# Altium schematic sheet TOP.SchDoc: Body Basher
size A4; CompanyName: COSIC; DrawnBy: Jakov Sola; Engineer: Jakov Sola; SheetNumber: 1; SheetTotal: 6; ENG_APP_DATE: --/--/--; DSN_APP_DATE: --/--/--; CHK_APP_DATE: --/--/--
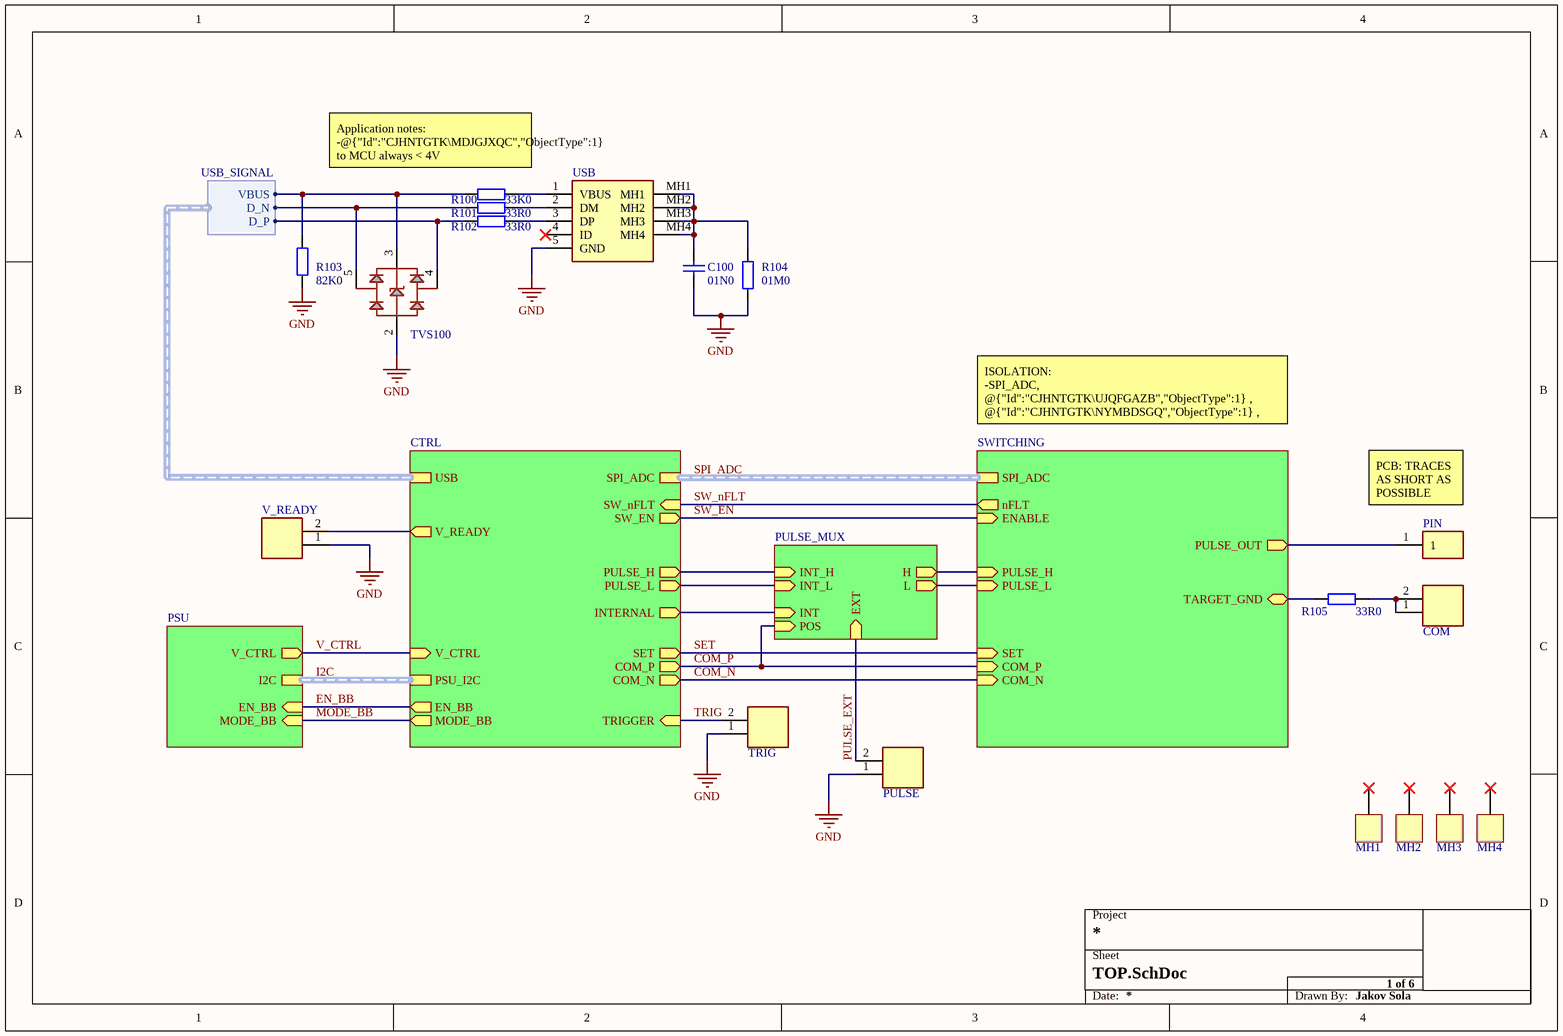
[diagram p0: TOP.SchDoc]

## Parts
C100  VALUE_4C: 01N0  [CAPC0805N]  (hidden comment: Cap)
COM  CON_2P  [2MMHBS02VT02HTB]  (value not drawn)
MH1  MH  [MH]  (value not drawn)  (no BOM)
MH2  MH  [MH]  (value not drawn)  (no BOM)
MH3  MH  [MH]  (value not drawn)  (no BOM)
MH4  MH  [MH]  (value not drawn)  (no BOM)
PIN  CON_1P  [POGO]  (value not drawn)
PULSE  CON_2P  [2MMHBS02VT02HTB]  (value not drawn)
R100  VALUE_4C: 33K0  [RESC0603N]  (hidden comment: Res)
R101  VALUE_4C: 33R0  [RESC0603N]  (hidden comment: Res)
R102  VALUE_4C: 33R0  [RESC0603N]  (hidden comment: Res)
R103  VALUE_4C: 82K0  [RESC0603N]  (hidden comment: Res)
R104  VALUE_4C: 01M0  [RESC0603N]  (hidden comment: Res)
R105  VALUE_4C: 33R0  [RESC0603N]  (hidden comment: Res)
TRIG  CON_2P  [2MMHBS02VT02HTB]  (value not drawn)
TVS100  SP3003_2X  [SC70_5]  (value not drawn)
USB  microUSB_CON  [476420001]  (value not drawn)
V_READY  CON_2P  [2MMHBS02VT02HTB]  (value not drawn)

## Sub-sheets
CTRL = CTRL.SchDoc: PULSE_H (out), PULSE_L (out), COM_P (out), COM_N (out), SET (out), SPI_ADC (harness SPI_ADC), TRIGGER (in), PSU_I2C (harness I2C), USB (harness USB_SIGNAL), MODE_BB (out), EN_BB (out), V_READY (out), SW_nFLT (in), SW_EN (out), INTERNAL (out), V_CTRL (in)
PSU = PSU.SchDoc: I2C (harness I2C), MODE_BB (in), EN_BB (in), V_CTRL (out)
PULSE_MUX = PULSE_MUX.SchDoc: INT_H (in), INT_L (in), EXT (in), H (out), L (out), INT (in), POS (in)
SWITCHING = SWITCHING.SchDoc: PULSE_H (in), PULSE_L (in), nFLT (out), ENABLE (in), PULSE_OUT (out), COM_P (in), COM_N (in), SET (in), TARGET_GND (bidir), SPI_ADC (harness SPI_ADC)

## Harnesses
USB_SIGNAL: D_P, D_N, VBUS

## Nets
GND: C100.1 PULSE.1 R103.1 R104.1 TRIG.1 TVS100.2 USB.5(GND) V_READY.1
COM_N: sheet SWITCHING/COM_N, sheet CTRL/COM_N
COM_P: sheet SWITCHING/COM_P, sheet CTRL/COM_P, sheet PULSE_MUX/POS
EN_BB: sheet PSU/EN_BB, sheet CTRL/EN_BB
MODE_BB: sheet PSU/MODE_BB, sheet CTRL/MODE_BB
PULSE_EXT: PULSE.2 ; sheet PULSE_MUX/EXT
SET: sheet SWITCHING/SET, sheet CTRL/SET
SW_EN: sheet SWITCHING/ENABLE, sheet CTRL/SW_EN
SW_nFLT: sheet SWITCHING/nFLT, sheet CTRL/SW_nFLT
TRIG: TRIG.2 ; sheet CTRL/TRIGGER
V_CTRL: sheet PSU/V_CTRL, sheet CTRL/V_CTRL
NetC100_2: C100.2 R104.2 USB.MH1 USB.MH2 USB.MH3 USB.MH4
NetCOM_1: COM.1 COM.2 R105.2
NetPIN_1: PIN.1 ; sheet SWITCHING/PULSE_OUT
NetR100_1: R100.1 USB.1(VBUS)
NetR100_2: R100.2 R103.2 TVS100.3 ; sheet CTRL/USB.VBUS
NetR101_1: R101.1 TVS100.5 ; sheet CTRL/USB.D_N
NetR101_2: R101.2 USB.2(DM)
NetR102_1: R102.1 TVS100.4 ; sheet CTRL/USB.D_P
NetR102_2: R102.2 USB.3(DP)
NetR105_1: R105.1 ; sheet SWITCHING/TARGET_GND
NetV_READY_2: V_READY.2 ; sheet CTRL/V_READY
(unnamed): sheet SWITCHING/PULSE_H, sheet PULSE_MUX/H
(unnamed): sheet SWITCHING/PULSE_L, sheet PULSE_MUX/L
(unnamed): sheet CTRL/PULSE_H, sheet PULSE_MUX/INT_H
(unnamed): sheet CTRL/PULSE_L, sheet PULSE_MUX/INT_L
(unnamed): sheet CTRL/INTERNAL, sheet PULSE_MUX/INT

Not connected (* = marked no-connect by the designer): MH1 0(MH)*; MH2 0(MH)*; MH3 0(MH)*; MH4 0(MH)*; USB 4(ID)*

## Buses and harness runs
harness I2C = sheet CTRL/PSU_I2C = sheet PSU/I2C
harness SPI_ADC = sheet CTRL/SPI_ADC = sheet SWITCHING/SPI_ADC

## Notes on the sheet
- Application notes:
  -@{"Id":"CJHNTGTK\MDJGJXQC","ObjectType":1} to MCU always < 4V
  -ESD protection
- ISOLATION:
  -SPI_ADC, @{"Id":"CJHNTGTK\UJQFGAZB","ObjectType":1} , @{"Id":"CJHNTGTK\NYMBDSGQ","ObjectType":1} , @{"Id":"CJHNTGTK\BMOAVTPZ","ObjectType":1} and @{"Id":"CJHNTGTK\TMLSETCT","ObjectType":1} isolated with ISOLATOR
  - @{"Id":"CJHNTGTK\TNVEIYGS","ObjectType":1} , @{"Id":"CJHNTGTK\KZAIASUD","ObjectType":1} and @{"Id":"CJHNTGTK\XAAZLINN","ObjectType":1} isolated with SSR inside SWITCHING
- (near PIN) PCB: TRACES AS SHORT AS POSSIBLE
- Project
- Sheet
- Date:
- Drawn By:

## Library data of the parts
C100 = 2238 600 15623: MANUF: PHYCOMP; DESCR: CAP 01N0 0805 100V X7R 10%; VENDOR: FARNELL INONE; VENDORCODE: 1362553; POPULATE: YES; VALUE_PF: 1000; VOLTAGE: 100V; TOLERANCE: 0.1; MANUFCODE: 2238 600 15623; PACKAGE: 0805; TECHNOLOGY: X7R
COM PULSE TRIG V_READY = 2MM-HB-S02-VT-02-H-TB: MANUF: TE CONNECTIVITY; DESCR: CON 2P 2MM HEADER; VENDOR: MOUSER; VENDORCODE: 571-2MM-HBS02VT02HTB; POPULATE: YES; MANUFCODE: 2MM-HB-S02-VT-02-H-TB
MH1-MH4 = MH: DESCR: MOUNTING HOLE; POPULATE: NA; MANUFCODE: MH
PIN = P25-0123: MANUF: HARWIN; DESCR: POGO PIN 15X5MM; VENDOR: MOUSER; VENDORCODE: 855-P25-0123; POPULATE: YES; MANUFCODE: P25-0123
R100 = CRCW060333K0FKEA: Resistor; MANUF: VISHAY; DESCR: RES 33K0 0603 0.1W 1% 75V 100PPM; VENDOR: DIGI-KEY; VENDORCODE: 541-33.0KHCT-ND; POPULATE: YES; VALUE_MOHM: 33000000; VALUE: 33K; POWER: 0.1W; TOLERANCE: 1%; VOLTAGE: 75V; TEMPCOEFF: 100PPM; NPOWER: 0.1; NTOLERANCE: 0.01; NVOLTAGE: 75; NTEMPCOEFF: 100; MANUFCODE: CRCW060333K0FKEA; PACKAGE: 0603; NVALUE: 33000000
R101 R102 R105 = CRCW060333R0FKEA: Resistor; MANUF: VISHAY; DESCR: RES 33R0 0603 0.1W 1% 75V 100PPM; VENDOR: DIGI-KEY; VENDORCODE: 541-33.0HCT-ND; POPULATE: YES; VALUE_MOHM: 33000; VALUE: 33R; POWER: 0.1W; TOLERANCE: 1%; VOLTAGE: 75V; TEMPCOEFF: 100PPM; NPOWER: 0.1; NTOLERANCE: 0.01; NVOLTAGE: 75; NTEMPCOEFF: 100; MANUFCODE: CRCW060333R0FKEA; PACKAGE: 0603; NVALUE: 33000
R103 = CRCW060382K0FKEA: Resistor; MANUF: VISHAY; DESCR: RES 82K0 0603 0.1W 1% 75V 100PPM; VENDOR: DIGI-KEY; VENDORCODE: 541-82.0KHCT-ND; POPULATE: YES; VALUE_MOHM: 82000000; VALUE: 82K; POWER: 0.1W; TOLERANCE: 1%; VOLTAGE: 75V; TEMPCOEFF: 100PPM; NPOWER: 0.1; NTOLERANCE: 0.01; NVOLTAGE: 75; NTEMPCOEFF: 100; MANUFCODE: CRCW060382K0FKEA; PACKAGE: 0603; NVALUE: 82000000
R104 = MC 0.063W 0603 1% 1M: Resistor; MANUF: MULTICOMP; DESCR: RES 01M0 0603 0.063W 1% 50V 100PPM; VENDOR: FARNELL INONE; VENDORCODE: 9330410; POPULATE: YES; VALUE_MOHM: 1000000000; VALUE: 1M; POWER: 0.063W; TOLERANCE: 1%; VOLTAGE: 50V; TEMPCOEFF: 100PPM; NPOWER: 0.063; NTOLERANCE: 0.01; NVOLTAGE: 50; NTEMPCOEFF: 100; MANUFCODE: MC 0.063W 0603 1% 1M; PACKAGE: 0603; NVALUE: 1000000000
TVS100 = SP3003-02JTG: MANUF: LITTELFUSE; DESCR: DIODE TVS DUAL 0.65PF SC70-5; VENDOR: DIGI-KEY; VENDORCODE: 1827640; POPULATE: YES; MANUFCODE: SP3003-02JTG; TYPE: TVS_BIDIR; QTY: DUAL; PACKAGE: SC70_5
USB = 47642-0001: MANUF: MOLEX; DESCR: CON MICRO USB 5P SMD; VENDOR: MOUSER; VENDORCODE: 538-47642-0001; POPULATE: YES; MANUFCODE: 47642-0001